# EAGLE design Adafruit 7seg backpack (EAGLE 6.2)
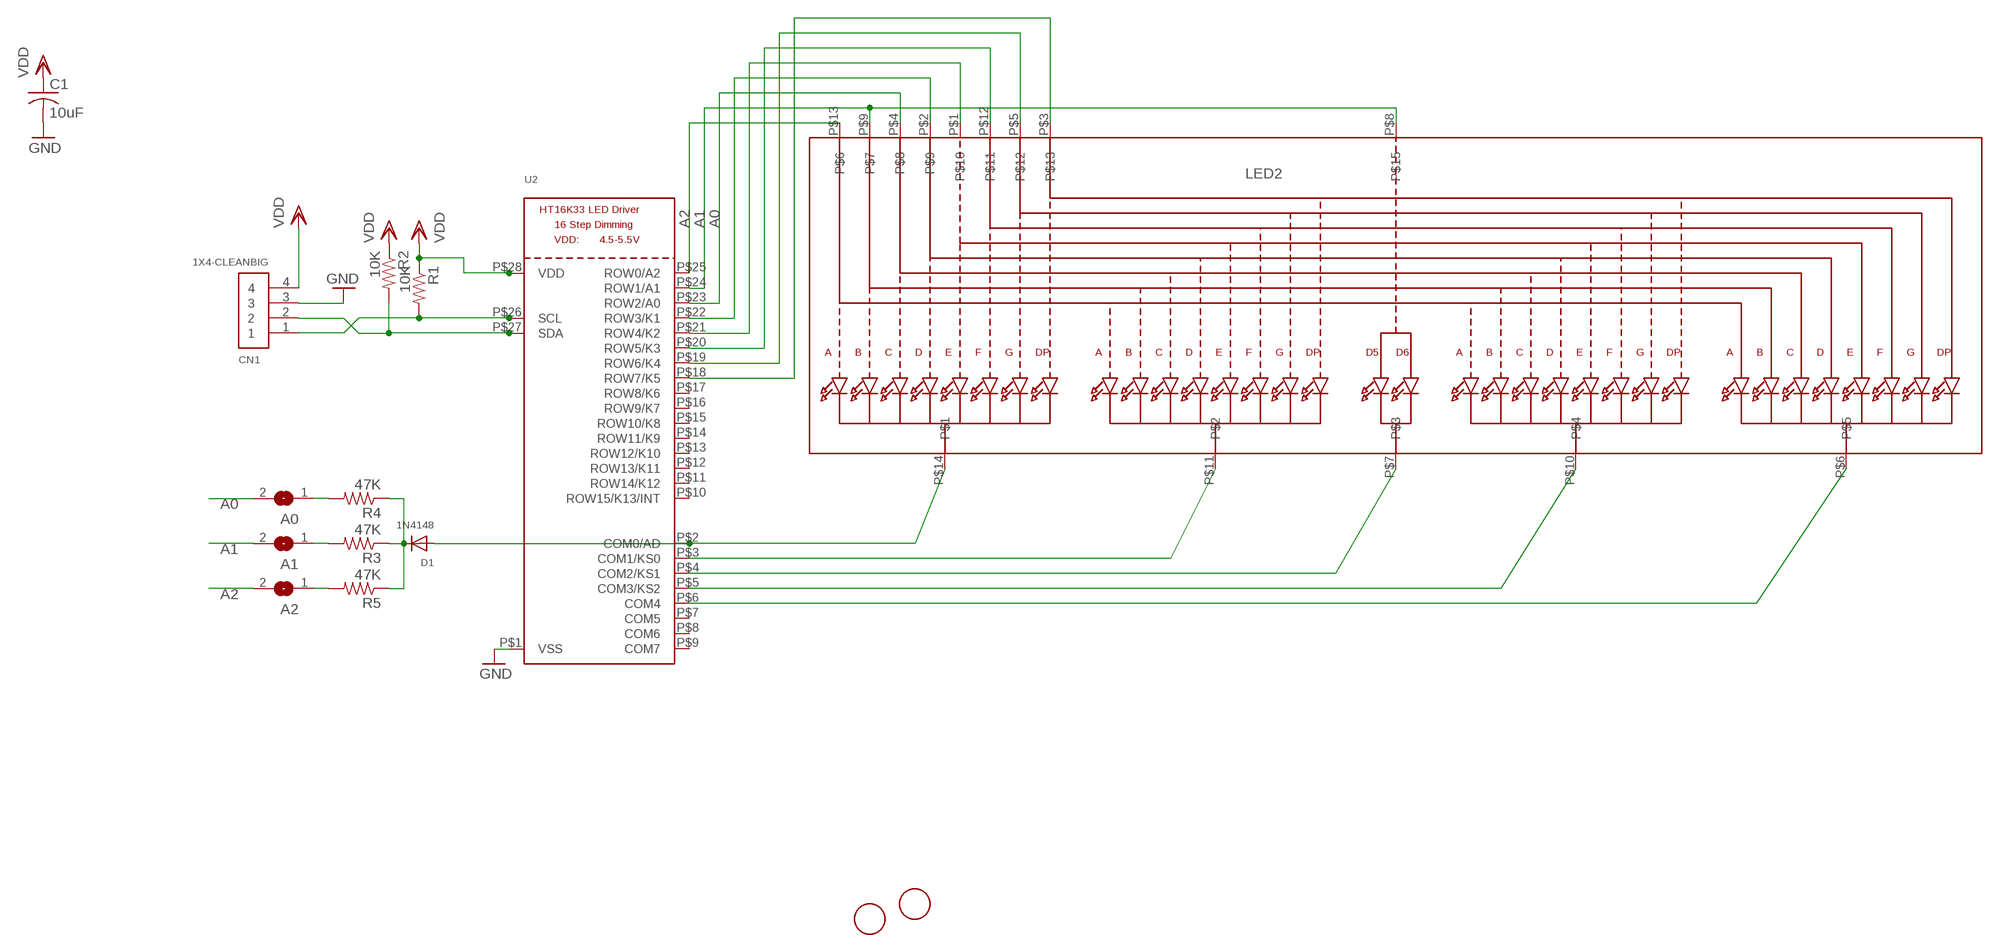
[diagram p0: schematic, sheet 1]

## Parts
A0  SOLDERJUMPERREFLOW_NOPASTE  [SOLDERJUMPER_REFLOW_NOPASTE]
A1  SOLDERJUMPERREFLOW_NOPASTE  [SOLDERJUMPER_REFLOW_NOPASTE]
A2  SOLDERJUMPERREFLOW_NOPASTE  [SOLDERJUMPER_REFLOW_NOPASTE]
C1  10uF  C-USC0805K  [C0805K]
CN1  1X4-CLEANBIG  [1X04-CLEANBIG]
D1  1N4148  DIODESOD-323F  [SOD-323F]
LED2  DISP_SEGMENT_4DIGIT_BL-Q56C43  [SEGMENT-BL-Q56C43]
R1  10K  R-US_R0805  [R0805]
R2  10K  R-US_R0805  [R0805]
R3  47K  R-US_R0805  [R0805]
R4  47K  R-US_R0805  [R0805]
R5  47K  R-US_R0805  [R0805]
U2  HT16K33_SOP28  [SOP28_300MIL]
U$1  FIDUCIAL  [FIDUCIAL_1MM]
U$2  FIDUCIAL  [FIDUCIAL_1MM]

## Nets
A0: A0.2 LED2.P$4 U2.P$23(ROW2/A0)
A1: A1.2 LED2.P$8 LED2.P$9 U2.P$24(ROW1/A1)
A2: A2.2 LED2.P$13 U2.P$25(ROW0/A2)
GND: C1.2 CN1.3 U2.P$1(VSS)
N$1: D1.C R3.1 R4.1 R5.1
N$2: D1.A LED2.P$14 U2.P$2(COM0/AD)
N$3: LED2.P$11 U2.P$3(COM1/KS0)
N$4: LED2.P$7 U2.P$4(COM2/KS1)
N$5: LED2.P$10 U2.P$5(COM3/KS2)
N$6: LED2.P$6 U2.P$6(COM4)
N$7: A2.1 R5.2
N$10: LED2.P$2 U2.P$22(ROW3/K1)
N$11: LED2.P$1 U2.P$21(ROW4/K2)
N$12: LED2.P$12 U2.P$20(ROW5/K3)
N$13: LED2.P$5 U2.P$19(ROW6/K4)
N$16: LED2.P$3 U2.P$18(ROW7/K5)
N$19: A1.1 R3.2
N$20: A0.1 R4.2
SCL: CN1.1 R1.2 U2.P$26(SCL)
SDA: CN1.2 R2.2 U2.P$27(SDA)
VDD: C1.1 CN1.4 R1.1 R2.1 U2.P$28(VDD)
Unconnected: U2.P$7(COM5) U2.P$8(COM6) U2.P$9(COM7) U2.P$10(ROW15/K13/INT) U2.P$11(ROW14/K12) U2.P$12(ROW13/K11) U2.P$13(ROW12/K10) U2.P$14(ROW11/K9) U2.P$15(ROW10/K8) U2.P$16(ROW9/K7) U2.P$17(ROW8/K6)

## Library data of the parts
A0 A1 A2 = microbuilder:SOLDERJUMPER: SMD Solder JUMPER Solder the two pads together to create a connection, or remove the solder to break it. REFLOW - Use this footprint for solder paste and reflow ovens. WAVE - Use this footprint for hand-soldering (larger pads). CLOSED - Has a trace between the two pads to ensure it is closed by default. The trace needs to be cut to disable the jumper, and can be closed again by creating a solder bridge between the two pads.
C1 = adafruit:C-US: CAPACITOR, American symbol
CN1 = adafruit:1X4: 4-pin connector
D1 = adafruit:DIODE: Diode SMADIODE - SMA Surface Mount Package 20V 1A Schottky Diode Digikey: 641-1014-6-ND DO-1N4148 - Through Hole Small Current Diode SOD-123 20V 1 A (.5mV Vf) Schottky Diode - Digikey: MBRX120TPMSCT-ND SOD-323 10V 570mA (.38mV Vf, 3ns) Schottky Diode - Digikey: ZLLS410CT-ND SOD-523 30V 30mA Schottky Diode (RB751S-40TE61) - Digikey: RB751S-40TE61CT-ND SOT23-R/W - SOT23 Package (R = Solder Paste/Reflow Ovens, W = Hand-Soldering) BAT54Film 40V 300mA - Digikey: 497-7162-1-ND
LED2 = microbuilder:DISP_SEGMENT_4DIGIT_BL-Q56C43
R1-R5 = adafruit:R-US_: RESISTOR, American symbol
U2 = microbuilder:HT16K33_SOP28
U$1 U$2 = adafruit:FIDUCIAL: For use by pick and place machines to calibrate the vision/machine, 1mm By microbuilder.eu

## Board
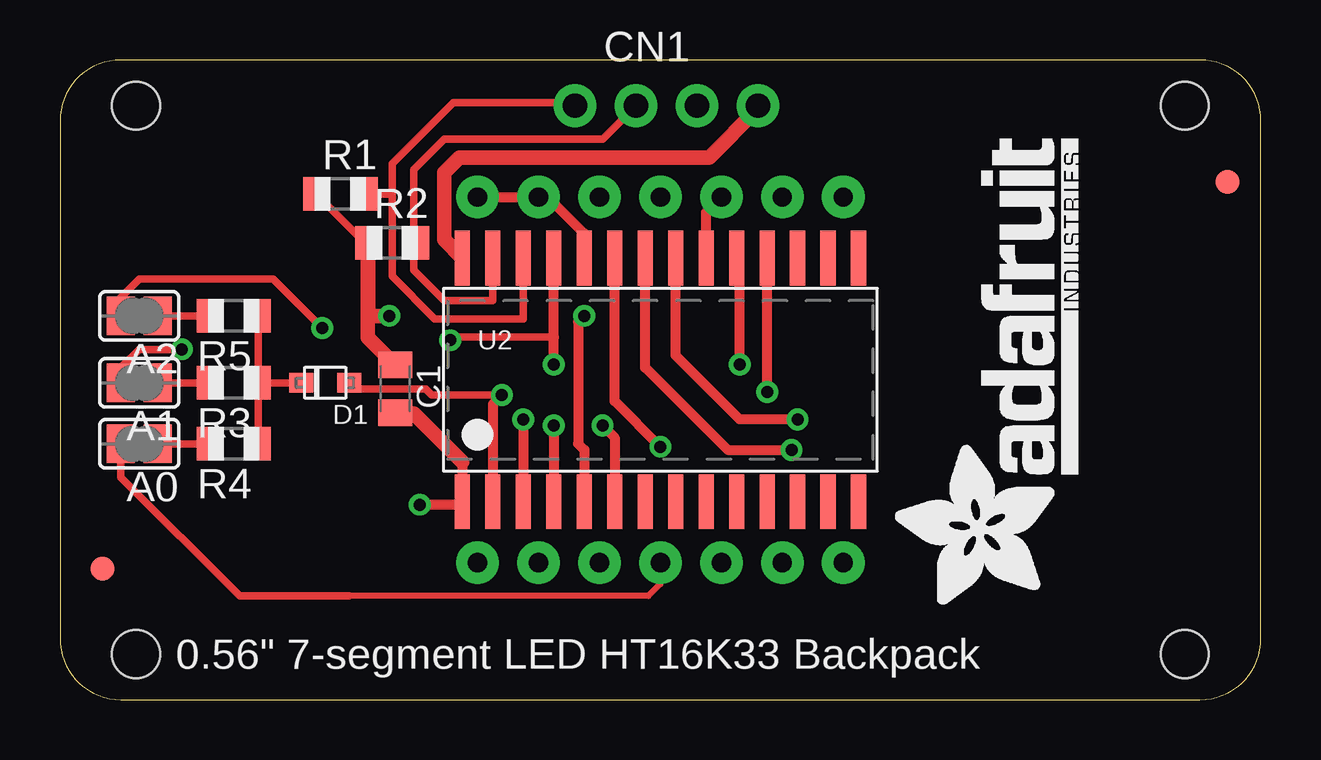
[diagram p1: board, top side]
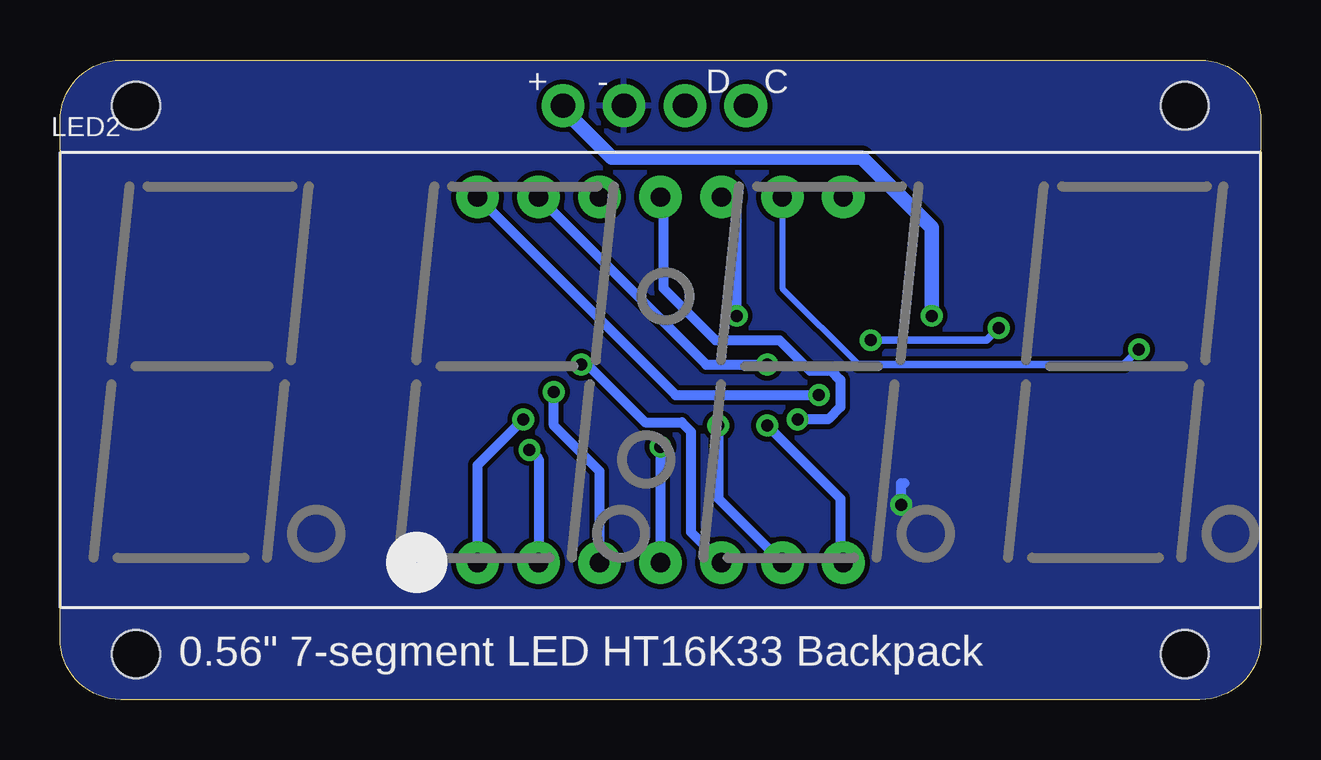
[diagram p2: board, bottom side, seen from below]

Size 50.04 x 26.67 mm. Coordinates in mm from the lower left corner, seen from the top.
Outline: 47.5,0 arc90 50.04,2.54 50.04,24.13 arc90 47.5,26.67 2.54,26.67 arc90 0,24.13 0,2.54 arc90 2.54,0 47.5,0
Copper layers (1*16): Top 0.035mm / dielectric 1.5mm / Bottom 0.035mm
Design rules: minimum track width 8mil, minimum drill 15mil, track to track 8mil, track to pad 8mil, pad to pad 8mil, via to via 8mil, smd to smd 8mil, copper to edge 1mil, drill to drill 8mil, minimum pad ring 10mil, minimum via ring 8mil, stop-mask expansion 4mil, vias tented up to drill 20mil, thermal gap 10mil
Holes 2 mm at 3.17,1.91 46.86,1.91 3.17,24.77 46.86,24.77

### Footprints (pad centres in the part's own frame; a part is rotated, then mirrored left to right if it is on the bottom)
SOLDERJUMPER_REFLOW_NOPASTE = smd 1.168 x 1.6: 1 -0.762,0; 2 0.762,0
C0805K = smd 1.1 x 1.4: 1 -1,0; 2 1,0
1X04-CLEANBIG = drill 1.016 pad 1.778: 1 -3.81,0; 2 -1.27,0; 3 1.27,0; 4 3.81,0
SOD-323F = smd 1 x 0.8: A -1,0; C 1,0
SEGMENT-BL-Q56C43 = drill 0.8 pad 1.778: P$1 -7.62,-7.62; P$2 -5.08,-7.62; P$3 -2.54,-7.62; P$4 0,-7.62; P$5 2.54,-7.62; P$6 5.08,-7.62; P$7 7.62,-7.62; P$8 7.62,7.62; P$9 5.08,7.62; P$10 2.54,7.62; P$11 0,7.62; P$12 -2.54,7.62; P$13 -5.08,7.62; P$14 -7.62,7.62
R0805 = smd 1.1 x 1.4: 1 -1,0; 2 1,0
SOP28_300MIL = smd 0.635 x 2.286: P$1 -8.255,-5.08; P$2 -6.985,-5.08; P$3 -5.715,-5.08; P$4 -4.445,-5.08; P$5 -3.175,-5.08; P$6 -1.905,-5.08; P$7 -0.635,-5.08; P$8 0.635,-5.08; P$9 1.905,-5.08; P$10 3.175,-5.08; P$11 4.445,-5.08; P$12 5.715,-5.08; P$13 6.985,-5.08; P$14 8.255,-5.08; P$15 8.255,5.08; P$16 6.985,5.08; P$17 5.715,5.08; P$18 4.445,5.08; P$19 3.175,5.08; P$20 1.905,5.08; P$21 0.635,5.08; P$22 -0.635,5.08; P$23 -1.905,5.08; P$24 -3.175,5.08; P$25 -4.445,5.08; P$26 -5.715,5.08; P$27 -6.985,5.08; P$28 -8.255,5.08
FIDUCIAL_1MM = smd 1 x 1: 1 0,0

### Placement (x,y rotation side)
A0  3.3,10.67 180 top
A1  3.3,13.21 180 top
A2  3.3,16 180 top
C1  13.97,12.95 270 top
CN1  25.27,24.77 0 top
D1  11.05,13.21 180 top
LED2  25.02,13.34 0 bottom
R1  11.68,21.08 0 top
R2  13.84,19.05 0 top
R3  7.24,13.21 180 top
R4  7.24,10.67 180 top
R5  7.24,16 180 top
U2  25.02,13.34 0 top
U$1  48.64,21.59 0 top
U$2  1.78,5.46 0 top
U$3  [ADAFRUIT_TEXT_20MM]  42.42,3.81 90 top

### Tracks (layer width: path | path; a pad name or v marks a point on that pad's centre or on a via)
A0  (via drill 0.5)
  Top 0.254: 12.05,4.32 24.51,4.32 25.02,4.83 LED2.P$4 25.02,5.84
  Top 0.305: 12.05,4.32 7.49,4.32 2.54,9.27 A0.2
  Top 0.406: U2.P$23 23.11,12.45 v25.02,10.54
  Bottom 0.406: v25.02,10.54 LED2.P$4
A1  (via drill 0.5)
  Top 0.305: v5.08,14.61 3.3,14.61 2.54,13.84 A1.2
  Top 0.406: LED2.P$8 19.81,20.96 19.94,21.08 LED2.P$9 20.32,20.96 21.84,19.43 U2.P$24
  Bottom 0.254: 19.94,21.08 LED2.P$9 19.94,17.14 16.76,13.97
  Bottom 0.305: 16.76,13.97 6.48,13.97 5.71,13.97 v5.08,14.61
A2  (via drill 0.5)
  Top 0.305: A2.2 2.54,16.76 3.3,17.53 8.89,17.53 v10.92,15.49 | v16.26,14.99 16.38,15.11 20.57,15.11
  Top 0.406: v20.57,13.97 20.57,15.11 U2.P$25
  Bottom 0.305: v10.92,15.49 11.43,14.99 v16.26,14.99
  Bottom 0.406: LED2.P$13 23.11,13.97 v20.57,13.97
GND  (via drill 0.5)
  Top 0.406: 16.76,9.91 U2.P$1 16.76,8.13 v14.99,8.13
  Top 0.61: C1.2 13.97,11.94 14.73,11.94 16.76,9.91
  Bottom 0.406: v14.99,8.13 14.99,9.02 14.86,9.02
  pour Bottom: 0,28.07 0,-0.38 50.04,-0.38 50.04,28.07
N$1
  Top 0.305: 8.25,13.22 8.25,13.34 | R4.1 8.25,10.68 8.25,13.22 | R5.1 8.25,15.61 8.25,13.22 | 8.25,13.22 R3.1 | 8.25,13.22 8.27,13.21 D1.C
N$2  (via drill 0.5)
  Top 0.305: D1.A 12.3,12.95 15.24,12.95 15.49,12.7 v18.41,12.7
  Top 0.406: U2.P$2 18.03,12.32 v18.41,12.7
  Bottom 0.406: v18.41,12.7 24.38,12.7 LED2.P$14
N$3  (via drill 0.5)
  Top 0.406: v19.3,11.68 U2.P$3
  Bottom 0.406: LED2.P$11 25.15,20.96 24.89,20.7 24.89,17.14 22.73,14.99 20.07,14.99 18.8,13.72 17.91,13.72 17.53,13.34 17.53,12.19 18.03,11.68 v19.3,11.68
N$4  (via drill 0.5)
  Top 0.406: v20.57,11.43 U2.P$4
  Bottom 0.406: LED2.P$7 17.53,5.72 17.53,8.38 v20.57,11.43
N$5  (via drill 0.5)
  Top 0.406: U2.P$5 21.84,10.41 21.59,10.67 21.59,15.75 v21.84,16
  Bottom 0.406: 22.61,21.08 LED2.P$10 21.84,20.32 v21.84,16
N$6  (via drill 0.5)
  Top 0.406: U2.P$6 23.11,10.92 v22.61,11.43
  Bottom 0.406: v22.61,11.43 22.61,8.38 LED2.P$6
N$7
  Top 0.305: R5.2 A2.1
N$10  (via drill 0.5)
  Top 0.406: U2.P$22 24.38,13.84 27.81,10.41 v30.48,10.41
  Bottom 0.406: v30.48,10.41 30.1,10.03 LED2.P$2
N$11  (via drill 0.5)
  Top 0.406: U2.P$21 25.65,14.35 28.32,11.68 v30.73,11.68
  Bottom 0.406: v30.73,11.68 32.64,9.78 LED2.P$1
N$12
  Top 0.406: U2.P$20 26.92,20.32 LED2.P$12
N$13  (via drill 0.5)
  Top 0.406: U2.P$19 28.32,18.41 v28.32,13.97
  Bottom 0.406: LED2.P$5 23.75,6.99 23.75,11.18 24.13,11.56 25.65,11.56 28.07,13.97 v28.32,13.97
N$16  (via drill 0.5)
  Top 0.406: v29.46,12.83 U2.P$18
  Bottom 0.406: v29.46,12.83 29.46,11.43 27.56,9.53 LED2.P$3
N$19
  Top 0.305: R3.2 A1.1
N$20
  Top 0.305: R4.2 A0.1
SCL
  Top 0.305: U2.P$26 19.3,15.88 15.62,15.88 13.84,17.65 13.84,21.08 | CN1.1 21.46,24.89 16.38,24.89 13.84,22.35 13.84,21.08 | 13.84,21.08 R1.2
SDA
  Top 0.305: U2.P$27 18.03,16.64 16,16.64 14.73,17.91 14.73,18.92 | CN1.2 22.61,23.37 16,23.37 14.73,22.1 14.73,18.92 | R2.2 14.73,18.92
VDD  (via drill 0.5)
  Top 0.305: R2.1 12.7,19.05 10.68,21.07 R1.1
  Top 0.61: U2.P$28 16,19.18 16,21.97 16.64,22.61 27.05,22.61 29.08,24.64 CN1.4 | C1.1 12.83,15.1 12.83,19.03 R2.1 12.84,16 v13.72,16
  Bottom 0.61: v13.72,16 13.72,19.69 16.64,22.61 27.05,22.61 29.08,24.64 CN1.4

### Text on the board
tPlace: 0.56" 7-segment LED HT16K33 Backpack
bPlace: C | D | - | + | 0.56" 7-segment LED HT16K33 Backpack
tDocu: SCL | SDA | GND | VCC | A2 | A1 | A0